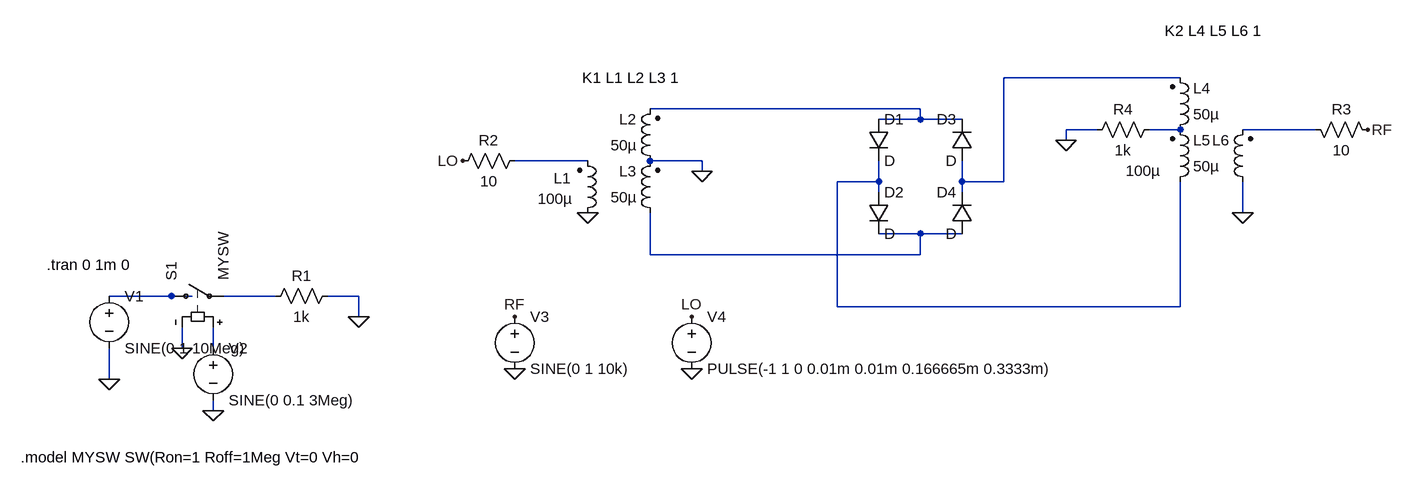
[diagram p0: schematic DoubleBalancedMixerTest.asc]
DoubleBalancedMixerTest.asc, the LTspice schematic file:
Version 4
SHEET 1 1232 680
WIRE 896 -272 624 -272
WIRE 496 -224 80 -224
WIRE 496 -208 496 -224
WIRE 496 -208 432 -208
WIRE 560 -208 496 -208
WIRE 768 -192 720 -192
WIRE 896 -192 848 -192
WIRE 1104 -192 992 -192
WIRE 720 -176 720 -192
WIRE -16 -144 -128 -144
WIRE 160 -144 80 -144
WIRE 160 -128 160 -144
WIRE 432 -112 432 -144
WIRE 432 -112 368 -112
WIRE 560 -112 560 -144
WIRE 624 -112 624 -272
WIRE 624 -112 560 -112
WIRE 432 -96 432 -112
WIRE 560 -96 560 -112
WIRE 992 -64 992 -112
WIRE 496 -32 432 -32
WIRE 560 -32 496 -32
WIRE 80 0 80 -64
WIRE 496 0 496 -32
WIRE 496 0 80 0
WIRE -656 64 -752 64
WIRE -624 64 -656 64
WIRE -496 64 -576 64
WIRE -368 64 -416 64
WIRE 368 80 368 -112
WIRE 896 80 896 -112
WIRE 896 80 368 80
WIRE -368 96 -368 64
WIRE -640 144 -640 112
WIRE -592 144 -592 112
WIRE -752 192 -752 144
WIRE -592 240 -592 224
FLAG -752 192 0
FLAG -640 144 0
FLAG -592 240 0
FLAG -368 96 0
FLAG 144 96 LO
FLAG -128 96 RF
FLAG -128 176 0
FLAG 144 176 0
FLAG 160 -128 0
FLAG -16 -64 0
FLAG -208 -144 LO
FLAG 1184 -192 RF
FLAG 720 -176 0
FLAG 992 -64 0
SYMBOL voltage -752 48 R0
WINDOW 123 0 0 Left 0
WINDOW 39 0 0 Left 0
SYMATTR InstName V1
SYMATTR Value SINE(0 1 10Meg)
SYMBOL sw -672 64 R270
SYMATTR InstName S1
SYMATTR Value MYSW
SYMBOL voltage -592 128 R0
WINDOW 123 0 0 Left 0
WINDOW 39 0 0 Left 0
SYMATTR InstName V2
SYMATTR Value SINE(0 0.1 3Meg)
SYMBOL res -400 48 R90
WINDOW 0 0 56 VBottom 2
WINDOW 3 32 56 VTop 2
SYMATTR InstName R1
SYMATTR Value 1k
SYMBOL voltage -128 80 R0
WINDOW 123 0 0 Left 0
WINDOW 39 0 0 Left 0
SYMATTR InstName V3
SYMATTR Value SINE(0 1 10k)
SYMBOL voltage 144 80 R0
WINDOW 123 0 0 Left 0
WINDOW 39 0 0 Left 0
SYMATTR InstName V4
SYMATTR Value PULSE(-1 1 0 0.01m 0.01m 0.166665m 0.3333m)
SYMBOL ind2 -32 -48 M180
WINDOW 0 -36 69 Left 2
WINDOW 3 -61 38 Left 2
SYMATTR InstName L1
SYMATTR Value 100µ
SYMATTR Type ind
SYMBOL ind2 96 -128 R180
WINDOW 0 36 80 Left 2
WINDOW 3 36 40 Left 2
SYMATTR InstName L2
SYMATTR Value 50µ
SYMATTR Type ind
SYMBOL ind2 96 -48 R180
WINDOW 0 36 80 Left 2
WINDOW 3 36 40 Left 2
SYMATTR InstName L3
SYMATTR Value 50µ
SYMATTR Type ind
SYMBOL diode 416 -208 R0
SYMATTR InstName D1
SYMBOL diode 416 -96 R0
SYMATTR InstName D2
SYMBOL diode 576 -144 R180
WINDOW 0 24 64 Left 2
WINDOW 3 24 0 Left 2
SYMATTR InstName D3
SYMBOL diode 576 -32 R180
WINDOW 0 24 64 Left 2
WINDOW 3 24 0 Left 2
SYMATTR InstName D4
SYMBOL res -112 -160 R90
WINDOW 0 0 56 VBottom 2
WINDOW 3 32 56 VTop 2
SYMATTR InstName R2
SYMATTR Value 10
SYMBOL ind2 880 -176 M180
WINDOW 0 36 80 Left 2
WINDOW 3 36 40 Left 2
SYMATTR InstName L4
SYMATTR Value 50µ
SYMATTR Type ind
SYMBOL ind2 880 -96 M180
WINDOW 0 36 80 Left 2
WINDOW 3 36 40 Left 2
SYMATTR InstName L5
SYMATTR Value 50µ
SYMATTR Type ind
SYMBOL ind2 1008 -96 R180
WINDOW 0 36 80 Left 2
WINDOW 3 142 33 Left 2
SYMATTR InstName L6
SYMATTR Value 100µ
SYMATTR Type ind
SYMBOL res 1088 -208 M90
WINDOW 0 0 56 VBottom 2
WINDOW 3 32 56 VTop 2
SYMATTR InstName R3
SYMATTR Value 10
SYMBOL res 864 -208 R90
WINDOW 0 0 56 VBottom 2
WINDOW 3 32 56 VTop 2
SYMATTR InstName R4
SYMATTR Value 1k
TEXT -848 16 Left 2 !.tran 0 1m 0
TEXT -888 312 Left 2 !.model MYSW SW(Ron=1 Roff=1Meg Vt=0 Vh=0
TEXT -24 -272 Left 2 !K1 L1 L2 L3 1
TEXT 872 -344 Left 2 !K2 L4 L5 L6 1

The netlist it stands for:
* DoubleBalancedMixerTest.asc
V1 N008 0 SINE(0 1 10Meg)
S1 N008 N009 N010 0 MYSW
V2 N010 0 SINE(0 0.1 3Meg)
R1 0 N009 1k
V3 RF 0 SINE(0 1 10k)
V4 LO 0 PULSE(-1 1 0 0.01m 0.01m 0.166665m 0.3333m)
L1 0 N005 100µ
L2 0 N002 50µ
L3 N007 0 50µ
D1 N002 N006 D
D2 N006 N007 D
D3 N001 N002 D
D4 N007 N001 D
R2 N005 LO 10
L4 N003 N001 50µ
L5 N006 N003 50µ
L6 0 N004 100µ
R3 N004 RF 10
R4 N003 0 1k
.model D D
.lib standard.dio
.tran 0 1m 0
.model MYSW SW(Ron=1 Roff=1Meg Vt=0 Vh=0
K1 L1 L2 L3 1
K2 L4 L5 L6 1
.backanno
.end